# EAGLE design hypernode (EAGLE 9.6.2)
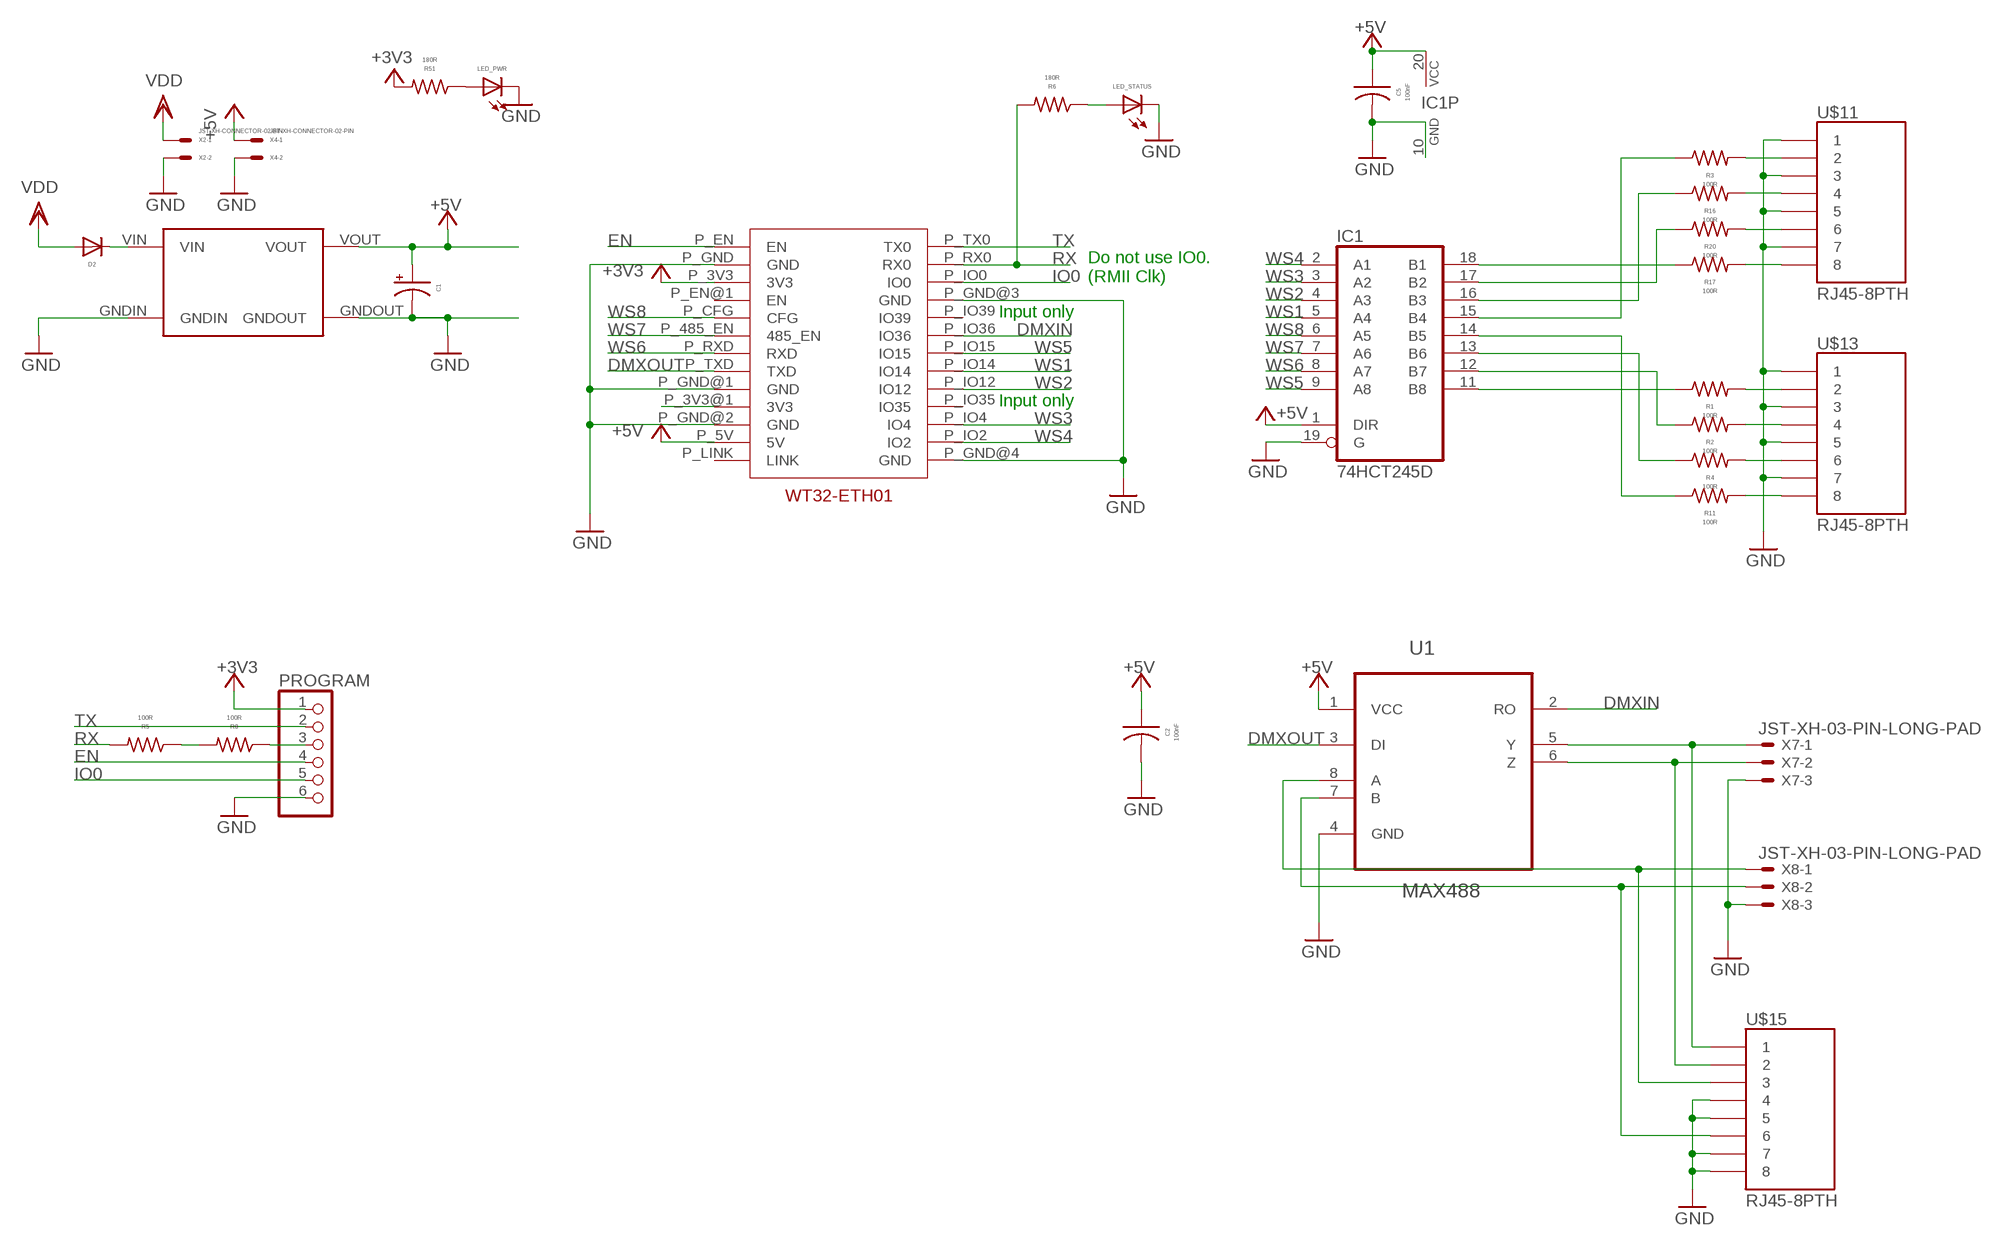
[diagram p0: schematic, sheet 1]

## Parts
C1  CAPACITOR_SMC-D  [RCL_SMC_D]
C2  100nF  CAPACITOR_0603  [ADAFRUIT_C0603]
C5  100nF  CAPACITOR_0603  [ADAFRUIT_C0603]
D2  DIODE_SMB  [DIODE_SMB]
IC1  74HCT245D  74AC245DW  [SO20W]
LED_PWR  LED0603  [ADAFRUIT_CHIPLED_0603]
LED_STATUS  LED0603  [ADAFRUIT_CHIPLED_0603]
PROGRAM  PINHD-1X6  [1X06]
R1  100R  RESISTOR  [ADAFRUIT_R0603]
R2  100R  RESISTOR  [ADAFRUIT_R0603]
R3  100R  RESISTOR  [ADAFRUIT_R0603]
R4  100R  RESISTOR  [ADAFRUIT_R0603]
R5  100R  RESISTOR  [ADAFRUIT_R0603]
R6  180R  RESISTOR  [ADAFRUIT_R0603]
R8  100R  RESISTOR  [ADAFRUIT_R0603]
R11  100R  RESISTOR  [ADAFRUIT_R0603]
R16  100R  RESISTOR  [ADAFRUIT_R0603]
R17  100R  RESISTOR  [ADAFRUIT_R0603]
R20  100R  RESISTOR  [ADAFRUIT_R0603]
R51  180R  RESISTOR  [ADAFRUIT_R0603]
U1  MAX488  MAX488CSA+  [SOIC127P600X175-8N]
U$3  STEPDOWNMODULE  [STEPDOWN_MODULE]
U$11  RJ45-8PTH  [RJ45-8]
U$13  RJ45-8PTH  [RJ45-8]
U$15  RJ45-8PTH  [RJ45-8]
U$17  WT32-ETH01WT32-ETH01-SMD  [WT32-ETH01-SMD]
X2  JST-XH-CONNECTOR-02-PIN  [REMBRANDT-ELECTRONICS---JST-XH-CONNECTORS-V1-0_JST-XH-02-PACKAGE-LONG-PAD]
X4  JST-XH-CONNECTOR-02-PIN  [REMBRANDT-ELECTRONICS---JST-XH-CONNECTORS-V1-0_JST-XH-02-PACKAGE-LONG-PAD]
X7  JST-XH-03-PIN-LONG-PAD  [JST-XH-03-PACKAGE-LONG-PAD]
X8  JST-XH-03-PIN-LONG-PAD  [JST-XH-03-PACKAGE-LONG-PAD]

## Nets
+3V3: PROGRAM.1 R51.2 U$17.P_3V3(3V3)
+5V: C1.+ C2.1 C5.1 IC1.1(DIR) IC1.20(VCC) U1.1(VCC) U$3.VOUT U$17.P_5V(5V) X4.1
DMXA: U1.8(A) U$15.3 X8.1
DMXB: U1.7(B) U$15.6 X8.2
DMXIN: U1.2(RO) U$17.P_IO36(IO36)
DMXOUT: U1.3(DI) U$17.P_TXD(TXD)
DMXY: U1.5(Y) U$15.1 X7.1
DMXZ: U1.6(Z) U$15.2 X7.2
EN: PROGRAM.4 U$17.P_EN(EN)
GND: C1.- C2.2 C5.2 IC1.10(GND) IC1.19(G) LED_PWR.C LED_STATUS.C PROGRAM.6 U1.4(GND) U$3.GNDIN U$3.GNDOUT U$11.1 U$11.3 U$11.5 U$11.7 U$13.1 U$13.3 U$13.5 U$13.7 U$15.4 U$15.5 U$15.7 U$15.8 U$17.P_GND(GND) U$17.P_GND@1(GND) U$17.P_GND@2(GND) U$17.P_GND@3(GND) U$17.P_GND@4(GND) X2.2 X4.2 X7.3 X8.3
IO0: PROGRAM.5 U$17.P_IO0(IO0)
N$1: R5.1 R8.2
N$2: LED_STATUS.A R6.1
N$3: R3.2 U$11.2
N$4: D2.C U$3.VIN
N$5: R16.2 U$11.4
N$6: R20.2 U$11.6
N$7: R17.2 U$11.8
N$8: R1.2 U$13.2
N$9: IC1.18(B1) R17.1
N$10: R2.2 U$13.4
N$11: IC1.17(B2) R20.1
N$12: IC1.16(B3) R16.1
N$13: IC1.15(B4) R3.1
N$14: IC1.14(B5) R11.1
N$15: IC1.13(B6) R4.1
N$16: IC1.12(B7) R2.1
N$17: IC1.11(B8) R1.1
N$18: R4.2 U$13.6
N$19: R11.2 U$13.8
N$20: U$17.P_3V3@1(3V3)
N$21: PROGRAM.3 R8.1
N$34: LED_PWR.A R51.1
RX: R5.2 R6.2 U$17.P_RX0(RX0)
TX: PROGRAM.2 U$17.P_TX0(TX0)
VDD: D2.A X2.1
WS1: IC1.5(A4) U$17.P_IO14(IO14)
WS2: IC1.4(A3) U$17.P_IO12(IO12)
WS3: IC1.3(A2) U$17.P_IO4(IO4)
WS4: IC1.2(A1) U$17.P_IO2(IO2)
WS5: IC1.9(A8) U$17.P_IO15(IO15)
WS6: IC1.8(A7) U$17.P_RXD(RXD)
WS7: IC1.7(A6) U$17.P_485_EN(485_EN)
WS8: IC1.6(A5) U$17.P_CFG(CFG)
Unconnected: U$17.P_EN@1(EN) U$17.P_IO35(IO35) U$17.P_IO39(IO39) U$17.P_LINK(LINK)

## Notes on the sheet
- Do not use IO0. 
  (RMII Clk)
- Input only
- Input only

## Library data of the parts
C1 = Multischriever:CAPACITOR_SMC-D: POLARIZED CAPACITOR, American symbol
C2 C5 = Multischriever:CAPACITOR_0603: CAPACITOR, American symbol
D2 = Multischriever:DIODE_SMB: DIODE
IC1 = 74xx-eu:74*245: Octal BUS TRANSCEIVER, 3-state; SPICEPREFIX: X
LED_PWR LED_STATUS = Multischriever:LED: LED
PROGRAM = pinhead:PINHD-1X6: PIN HEADER
R1-R6 R8 R11 R16 R17 R20 R51 = Multischriever:RESISTOR: RESISTOR, American symbol
U1 = Maxim_By_element14_Batch_1:MAX488CSA+: Low-Power, Slew-Rate-Limited RS-485/RS-422 Transceivers; MPN: MAX488CSA+; OC_FARNELL: 9724966; OC_NEWARK: 87H1402; PACKAGE: SOIC-8; SUPPLIER: Maxim
U$3 = Multischriever:STEPDOWNMODULE
U$11 U$13 U$15 = SparkFun-Connectors:RJ45-8: RJ45 Jack Simple RJ45, 8-pin connection - connector for common Cat5, Cat5e, and Cat6 Ethernet cables. Footprint not yet proven in production. Connector sku is PRT-00643; Breakout PCB sku is BOB-00716.
U$17 = Multischriever:WT32-ETH01
X2 X4 = Multischriever:JST-XH-CONNECTOR-02-PIN: JST XH Connector 2 Pin Pitch: 2,54 mm, (0.100")
X7 X8 = Rembrandt Electronics - JST XH Connectors v1-0:JST-XH-03-PIN: JST XH Connector 2 Pin Wire to board connector. Pitch: 2,54 mm, (0.100") Number of pins: 3 Created by Rembrandt Electronics www.rembrandtelectronics.com

## Board
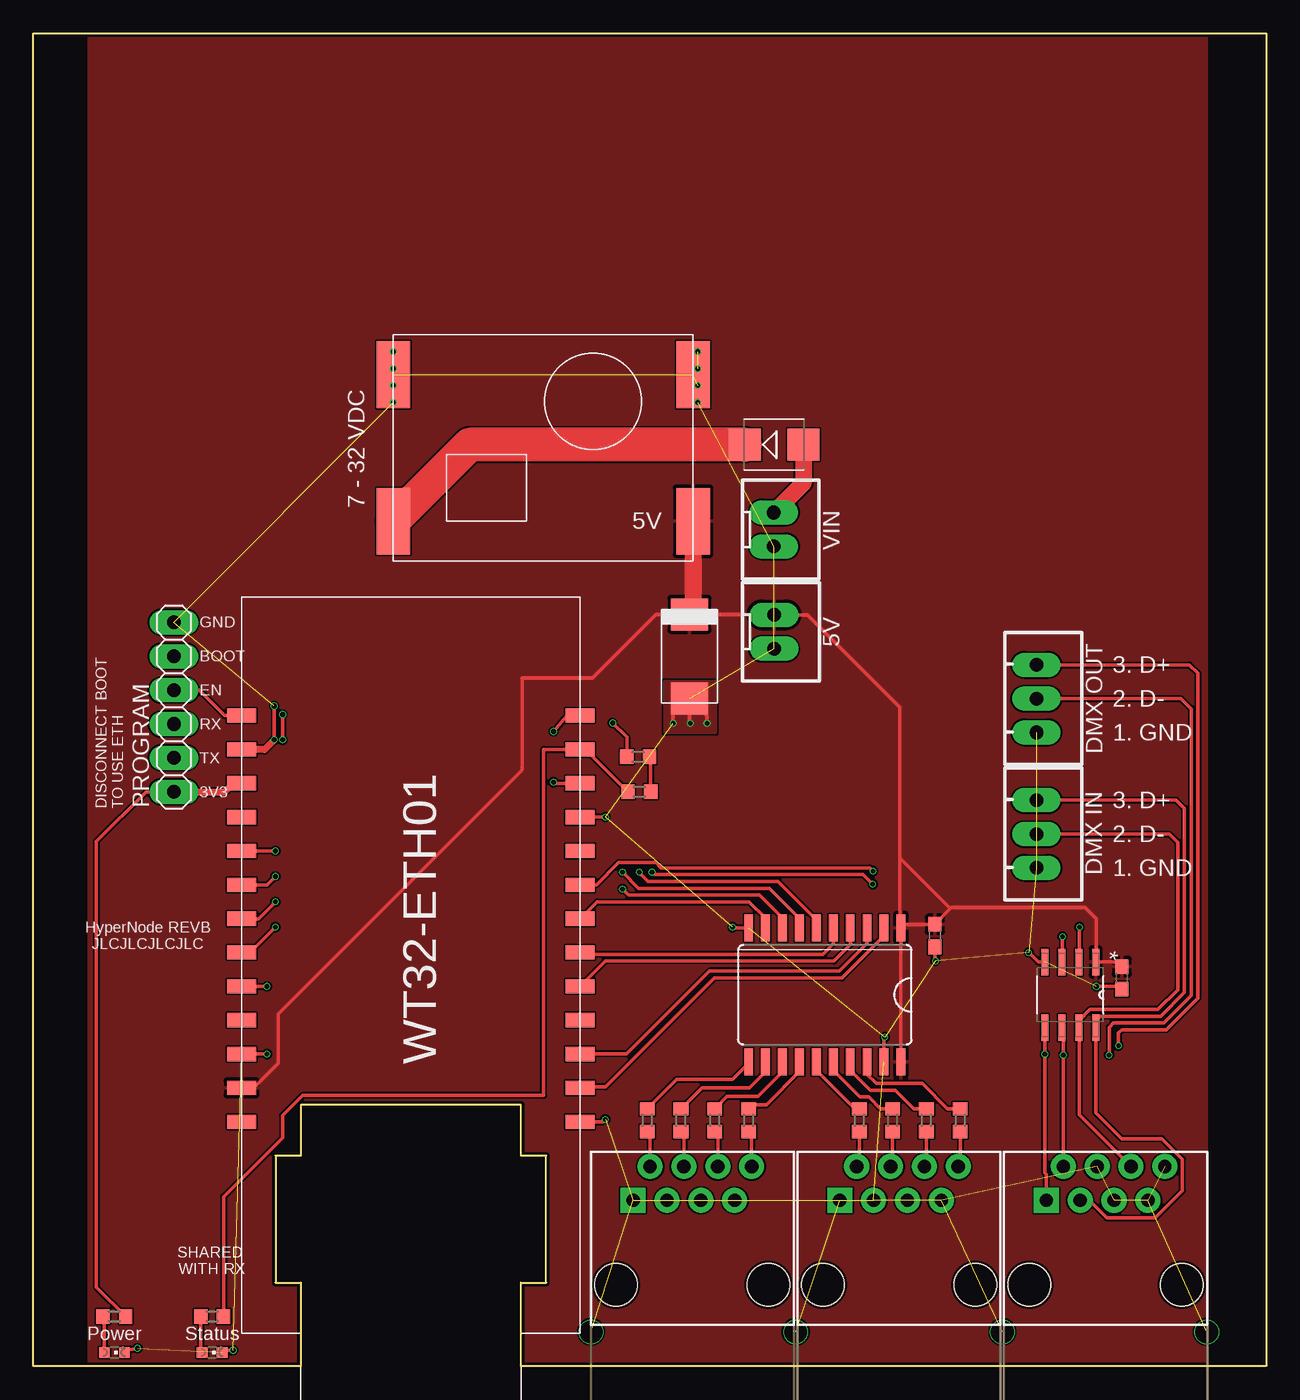
[diagram p1: board, top side]
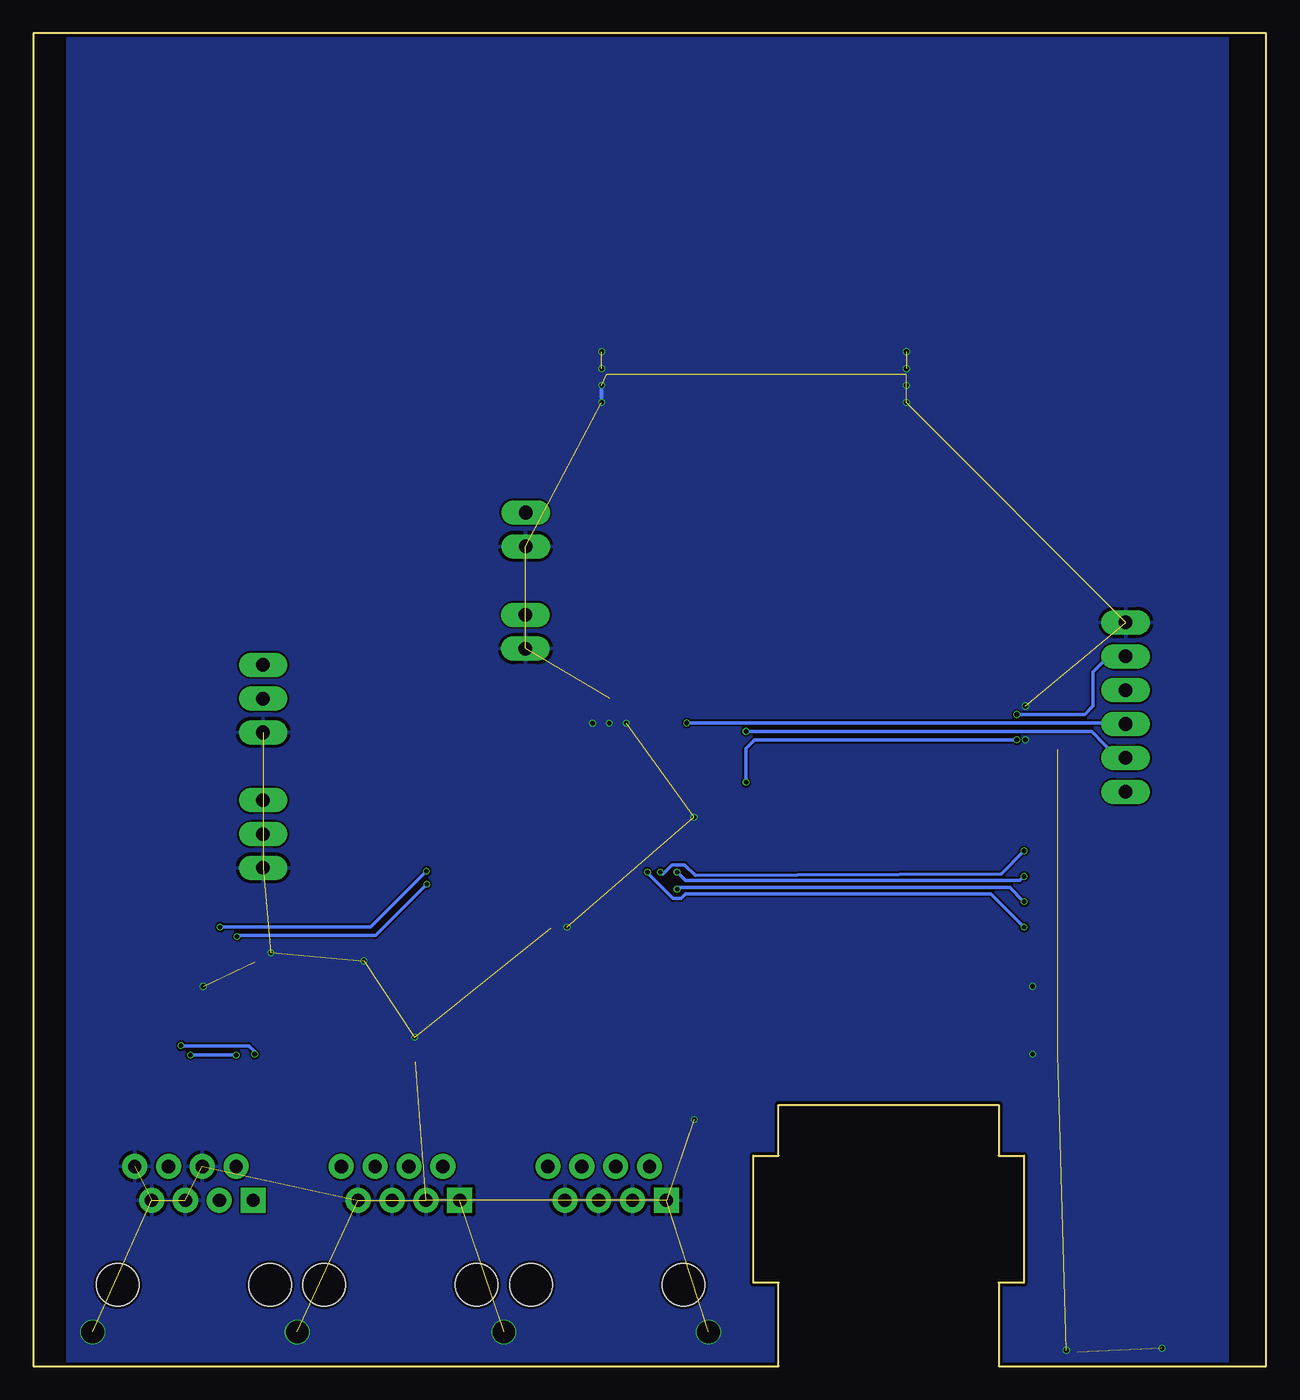
[diagram p2: board, bottom side, seen from below]

Size 92.5 x 100 mm. Coordinates in mm from the lower left corner, seen from the top.
Outline: 0,0 0,100 92.5,100 92.5,0 36.58,0 36.58,6.27 38.48,6.27 38.48,15.79 36.58,15.79 36.58,19.61 20.07,19.61 20.07,15.79 18.16,15.79 18.16,6.27 20.07,6.27 20.07,0 0,0
Copper layers (1*16): Top 0.035mm / dielectric 1.6mm / Bottom 0.035mm
Design rules "jlcpcb-2layers *": minimum track width 5mil, minimum drill 0.3mm, track to track 5mil, track to pad 5mil, pad to pad 5mil, via to via 5mil, smd to smd 5mil, copper to edge 0.2mm, drill to drill 6mil, minimum pad ring 10mil, minimum via ring 3mil, stop-mask expansion 4mil, vias tented up to drill 15mil, thermal gap 10mil
tKeepout: area 0,-0.1 to 3,100.2; area 89.5,-1.3 to 92.5,101.5
bKeepout: area 88.5,-2.6 to 92.5,100.2; area 0,0 to 4,102.9

### Footprints (pad centres in the part's own frame; a part is rotated, then mirrored left to right if it is on the bottom)
RCL_SMC_D = smd 2.4 x 2.8: + -3.15,0; - 3.15,0
ADAFRUIT_C0603 = smd 1.1 x 1: 1 -0.85,0; 2 0.85,0
DIODE_SMB = smd 2.4 x 2.4: A 2.2,0; C -2.2,0
SO20W = smd 0.66 x 2.032: 1 -5.715,-5.029; 2 -4.445,-5.029; 3 -3.175,-5.029; 4 -1.905,-5.029; 5 -0.635,-5.029; 6 0.635,-5.029; 7 1.905,-5.029; 8 3.175,-5.029; 9 4.445,-5.029; 10 5.715,-5.029; 11 5.715,5.029; 12 4.445,5.029; 13 3.175,5.029; 14 1.905,5.029; 15 0.635,5.029; 16 -0.635,5.029; 17 -1.905,5.029; 18 -3.175,5.029; 19 -4.445,5.029; 20 -5.715,5.029
ADAFRUIT_CHIPLED_0603 = smd 0.8 x 0.8: A 0,-0.75; C 0,0.75
1X06 = drill 1.016 long: 1 -6.35,0; 2 -3.81,0; 3 -1.27,0; 4 1.27,0; 5 3.81,0; 6 6.35,0
ADAFRUIT_R0603 = smd 1 x 1.1: 1 -0.85,0; 2 0.85,0
SOIC127P600X175-8N = smd 1.981 x 0.533: 1 -2.464,1.905; 2 -2.464,0.635; 3 -2.464,-0.635; 4 -2.464,-1.905; 5 2.464,-1.905; 6 2.464,-0.635; 7 2.464,0.635; 8 2.464,1.905
STEPDOWN_MODULE = smd 5 x 2.5: GNDIN 3,0; GNDOUT 3,22.5; VIN 14,0; VOUT 14,22.5
RJ45-8 = drill 1 pad 1.88 square: 1 -4.445,6.35 | drill 1 pad 1.88: 2 -3.175,8.89; 3 -1.905,6.35; 4 -0.635,8.89; 5 0.635,6.35; 6 1.905,8.89; 7 3.175,6.35; 8 4.445,8.89 | hole 3.2: -5.715,0; 5.715,0
WT32-ETH01-SMD = smd 2.184 x 1.067: P_3V3 -0.635,-5.08; P_3V3@1 -0.635,-22.86; P_5V -0.635,-27.94; P_485_EN -0.635,-12.7; P_CFG -0.635,-10.16; P_EN -0.635,0; P_EN@1 -0.635,-7.62; P_GND -0.635,-2.54; P_GND@1 -0.635,-20.32; P_GND@2 -0.635,-25.4; P_GND@3 24.765,-7.62; P_GND@4 24.765,-30.48; P_IO0 24.765,-5.08; P_IO2 24.765,-27.94; P_IO4 24.765,-25.4; P_IO12 24.765,-20.32; P_IO14 24.765,-17.78; P_IO15 24.765,-15.24; P_IO35 24.765,-22.86; P_IO36 24.765,-12.7; P_IO39 24.765,-10.16; P_LINK -0.635,-30.48; P_RX0 24.765,-2.54; P_RXD -0.635,-15.24; P_TX0 24.765,0; P_TXD -0.635,-17.78
REMBRANDT-ELECTRONICS---JST-XH-CONNECTORS-V1-0_JST-XH-02-PACKAGE-LONG-PAD = drill 1.016 long: 1 -1.27,0; 2 1.27,0
JST-XH-03-PACKAGE-LONG-PAD = drill 1.016 long: 1 -2.54,0; 2 0,0; 3 2.54,0

### Placement (x,y rotation side)
C1  49.23,53.26 270 top
C2  81.67,29.13 270 top
C5  67.64,32.3 270 top
D2  55.58,69.14 0 top
IC1  59.38,27.86 180 top
LED_PWR  6.08,1.03 270 top
LED_STATUS  13.42,1.03 270 top
PROGRAM  10.54,49.45 90 top
R1  46.05,18.46 270 top
R2  48.59,18.46 270 top
R3  61.98,18.46 270 top
R4  51.13,18.46 270 top
R5  45.47,43.1 180 top
R6  13.42,3.73 0 top
R8  45.38,45.72 0 top
R11  53.67,18.46 270 top
R16  64.47,18.46 270 top
R17  69.55,18.46 270 top
R20  67,18.46 270 top
R51  6.08,3.73 0 top
U1  77.8,27.86 270 top
U$3  27,77.39 270 top
U$4  [MULTISCHRIEVERLOGO_SOLDERMASK]  8.59,36.75 0 top
U$11  64.95,6.09 0 top
U$13  49.45,6.09 0 top
U$15  80.45,6.09 0 top
U$17  16.26,48.81 0 top
X2  55.55,62.77 270 top
X4  55.58,55.1 270 top
X7  75.26,50.09 270 top
X8  75.26,39.92 270 top

### Tracks (layer width: path | path; a pad name or v marks a point on that pad's centre or on a via)
+3V3
  Top 0.254: 14.99,43.73 U$17.P_3V3 | PROGRAM.1 8.46,43.1 4.74,39.37 4.74,5.92 R51.2
  Top 0.508: PROGRAM.1 14.36,43.1 14.99,43.73
+5V
  Top 0.254: U1.1 79.76,30.32 | 79.76,30.32 81.32,30.32 C2.1 | U$17.P_5V 15.88,20.62 16.26,20.62 18.37,22.72 18.37,26.42 36.68,44.73 36.68,51.63 41.94,51.63 46.72,56.41 C1.+ 55.54,56.41 X4.1 58.08,56.38 65.03,49.42 65.03,38.1 | 68.82,34.34 C5.1 65.37,33.16 IC1.1 | 68.82,34.34 68.91,34.42 78.91,34.42 79.76,33.58 79.76,30.32 | IC1.1 IC1.20 | 65.03,38.1 65.03,32.96 IC1.1 | 68.82,34.34 65.06,38.1 65.03,38.1
  Top 1.27: U$3.VOUT 49.5,56.18 C1.+
  pour Top (rank 3): 4.2,-1.35 88.02,-1.35 88.02,100.89 4.2,100.89
DMXA
  Top 0.254: X8.1 85.73,42.47 86.36,41.83 86.36,28.03 84.59,26.26 80.06,26.26 79.7,25.9 U1.8 79.7,19.02 81.67,17.07 84.68,17.07 86.22,15.53 86.22,13.16 84.18,11.12 80.54,11.12 79.22,12.44 U$15.3
DMXB
  Top 0.254: U$15.6 78.49,18.85 78.49,25.34 U1.7 78.44,25.92 79.28,26.77 84.38,26.77 85.86,28.24 85.86,39.29 85.22,39.92 X8.2
DMXIN  (via drill 0.35)
  Top 0.254: U$17.P_IO36 42.25,36.12 43.91,37.78 46.72,37.78 47.11,37.38 62.76,37.38 v63,37.14 | v78.49,32.94 78.49,30.38 U1.2
  Bottom 0.254: v63,37.14 67.2,32.94 v78.49,32.94
DMXOUT  (via drill 0.35)
  Top 0.254: U$17.P_TXD 16.26,31.04 v18.16,32.94 | v46.42,37.07 46.61,36.88 62.26,36.88 v62.98,36.16 | v77.22,32.23 77.22,30.38 U1.3
  Bottom 0.254: v18.16,32.94 20.64,35.42 43.58,35.42 43.91,35.09 44.49,35.09 46.42,37.02 v46.42,37.07 | v62.98,36.16 66.83,32.3 77.22,32.3 v77.22,32.23
DMXY  (via drill 0.35)
  Top 0.254: U$15.1 76.01,14.38 75.89,14.5 v75.89,23.41 U1.5 | X7.1 86.75,52.62 87.38,51.99 87.38,27.61 85.01,25.24 81.67,25.24 81.42,25 v81.42,24.05
  Bottom 0.254: v81.42,24.05 76.34,24.05 75.89,23.6 v75.89,23.41
DMXZ  (via drill 0.35)
  Top 0.254: U$15.2 v77.28,23.34 77.28,25.28 U1.6 | X7.2 86.11,50.09 86.87,49.32 86.87,27.82 84.8,25.75 81.03,25.75 80.71,25.43 v80.71,23.34
  Bottom 0.254: v80.71,23.34 v77.28,23.34
EN
  Top 0.254: PROGRAM.4 12.45,50.72 14.36,48.81 U$17.P_EN
GND  (via drill 0.35, 1.7)  (40 unrouted)
  Top 0.254: U$3.GNDOUT 49.5,74.49 v49.86,74.85 | U$3.GNDIN v27,74.85 | v42.93,41.2 U$17.P_GND@3 | U$17.P_GND@2 v17.53,23.41 | U$17.P_GND@1 v17.53,28.5 | C2.2 81.45,28.5 v79.76,28.5 | C5.2 67.64,30.45 v67.69,30.4 | C1.- 48.01,48.9 v48.01,48.23 | C1.- 49.23,48.29 v49.28,48.23 | C1.- 50.55,48.78 v50.55,48.23 | IC1.10 52.51,32.89 v52.45,32.94 | IC1.19 63.83,24.63 v63.89,24.68 | U1.4 75.39,30.32 v74.68,31.04 | LED_PWR.C 6.99,1.19 v7.81,1.35 | v14.99,1.19 14.33,1.19 LED_STATUS.C | v42.91,18.51 42.74,18.34 U$17.P_GND@4 | 17.32,46.24 17.21,46.27 | v18.07,49.53 v18.07,46.99
  Top 0.508: v18.07,46.99 17.32,46.24 | 17.21,46.27 U$17.P_GND
  Bottom 0.254: v49.86,73.58 v49.86,72.31
  other vias: 27,76.12 27,73.58 27,72.31 49.86,76.12 57.2,2.57 41.84,2.57 72.7,2.57 88.04,2.57
  pour Bottom: 2.92,-0.71 89.92,-0.71 89.92,101.52 2.92,101.52
  pour Top (rank 2, no thermals): 47.38,51.35 51.19,51.35 51.19,47.55 47.38,47.55
IO0  (via drill 0.35)
  Top 0.254: U$17.P_IO0 39.1,43.73 v39.02,43.81 | v18.7,48.9 v18.7,46.99
  Bottom 0.254: PROGRAM.5 11.64,53.26 11.72,53.34 12.99,52.07 12.99,49.53 13.62,48.9 v18.7,48.9 | v39.02,43.81 39.02,46.35 38.39,46.99 v18.7,46.99
N$1
  Top 0.254: R8.2 46.32,45.62 R5.1
N$2
  Top 0.254: LED_STATUS.A 12.57,1.13 R6.1
N$3
  Top 0.254: R3.2 61.98,15.19 U$11.2
N$4
  Top 2.54: D2.C 32.74,69.14 U$3.VIN
N$5
  Top 0.254: R16.2 64.47,15.13 U$11.4
N$6
  Top 0.254: R20.2 67,15.13 U$11.6
N$7
  Top 0.254: R17.2 69.55,15.13 U$11.8
N$8
  Top 0.254: R1.2 46.27,17.39 U$13.2
N$9
  Top 0.254: R17.1 68.59,19.31 66.7,21.21 63.25,21.21 62.56,21.9 IC1.18
N$10
  Top 0.254: R2.2 48.81,17.39 U$13.4
N$11
  Top 0.254: IC1.17 61.34,22.78 61.34,22.14 62.79,20.7 64.67,20.7 66.05,19.31 R20.1
N$12
  Top 0.254: R16.1 63.57,19.31 62.69,20.19 62.03,20.19 60.02,22.2 IC1.16
N$13
  Top 0.254: R3.1 61.64,19.31 58.75,22.2 IC1.15
N$14
  Top 0.254: R11.1 53.97,19.61 54.99,19.61 57.53,22.14 57.53,22.78 IC1.14
N$15
  Top 0.254: R4.1 52.06,20.24 54.36,20.24 56.27,22.14 56.27,22.78 IC1.13
N$16
  Top 0.254: R2.1 50.16,20.88 53.73,20.88 54.99,22.14 54.99,22.78 IC1.12
N$17
  Top 0.254: R1.1 48.25,21.51 52.45,21.51 53.73,22.78 IC1.11
N$18
  Top 0.254: R4.2 51.35,17.39 U$13.6
N$19
  Top 0.254: R11.2 53.89,17.39 U$13.8
N$21  (via drill 0.35)
  Top 0.254: v43.47,48.26 44.52,47.2 R8.1
  Bottom 0.254: PROGRAM.3 11.01,48.18 11.09,48.26 v43.47,48.26
N$34
  Top 0.254: R51.1 5.33,3.63 LED_PWR.A
RX
  Top 0.254: R6.2 14.27,12.71 18.7,17.14 18.7,18.81 20.21,20.32 38.28,20.32 38.28,46.27 U$17.P_RX0 41.45,46.27 R5.2
TX  (via drill 0.35)
  Top 0.254: v39.02,47.62 40.06,48.81 U$17.P_TX0
  Bottom 0.254: PROGRAM.2 11.18,45.64 13.09,47.62 38.72,47.62 v39.02,47.62
VDD
  Top 1.27: D2.A 57.77,66.27 X2.1
WS1
  Top 0.254: IC1.5 60.03,32.88 60.03,31.71 59.23,30.91 41.15,30.91 U$17.P_IO14
WS2
  Top 0.254: IC1.4 61.29,31.73 61.34,31.67 60.08,30.4 42.93,30.4 U$17.P_IO12
WS3
  Top 0.254: IC1.3 62.56,31.72 60.48,29.64 50.74,29.64 44.52,23.41 U$17.P_IO4
WS4
  Top 0.254: IC1.2 63.91,32.81 63.91,32.35 60.69,29.13 51.09,29.13 42.91,20.95 41.02,20.95 U$17.P_IO2
WS5
  Top 0.254: U$17.P_IO15 42.3,34.84 53.71,34.84 54.94,33.62 IC1.9
WS6  (via drill 0.35)
  Top 0.254: v18.16,34.84 16.89,33.58 U$17.P_RXD | v44.2,35.8 44.65,35.35 54.49,35.35 56.27,33.58 56.27,32.94 IC1.8
  Bottom 0.254: v18.16,34.84 19.24,35.92 44.07,35.92 v44.2,35.8
WS7  (via drill 0.35)
  Top 0.254: v18.16,36.75 17.53,36.12 U$17.P_485_EN | v44.2,37.07 45.41,35.86 55.25,35.86 57.53,33.58 57.53,32.94 IC1.7
  Bottom 0.254: v18.16,36.75 18.48,36.43 43.56,36.43 v44.2,37.07
WS8  (via drill 0.35)
  Top 0.254: v18.16,38.66 U$17.P_CFG | v45.47,37.07 45.47,37 46.1,36.37 55.88,36.37 58.68,33.58 58.8,33.58 58.8,32.94 IC1.6
  Bottom 0.254: v18.16,38.66 19.88,36.94 42.84,36.83 43.63,37.62 44.58,37.62 45.26,36.94 45.34,36.94 v45.47,37.07

### Text on the board
Measures: FRONT PANEL WIDTH
_tsilk: 7 - 32 VDC | 5V | VIN | 5V | 3. D+ | DMX OUT | 2. D- | GND / / BOOT / / EN / / RX / / TX / / 3V3 | 1. GND | DISCONNECT BOOT / TO USE ETH | 3. D+ | DMX IN | 2. D- | 1. GND | HyperNode REVB / JLCJLCJLCJLC | SHARED / WITH RX | Power | Status